# EAGLE schematic spi_lcd_v2 (EAGLE 6.1)
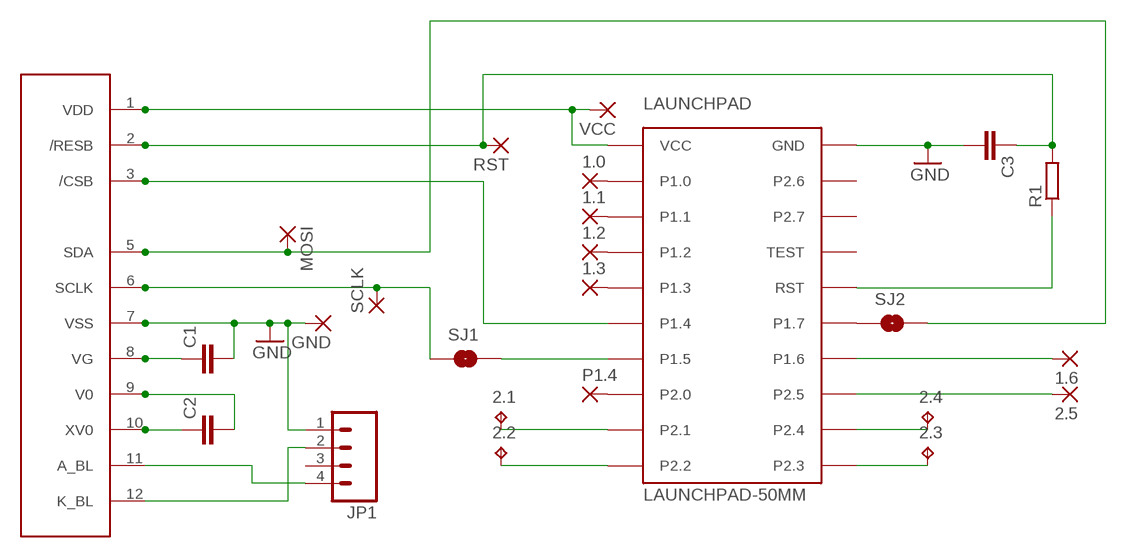
[diagram p0: schematic, sheet 1]

## Parts
1.0  2,15/1,0  [2,15/1,0]
1.1  2,15/1,0  [2,15/1,0]
1.2  2,15/1,0  [2,15/1,0]
1.3  2,15/1,0  [2,15/1,0]
1.6  2,15/1,0  [2,15/1,0]
2.1  TPTP07R  [TP07R]
2.2  TPTP07R  [TP07R]
2.3  TPTP07R  [TP07R]
2.4  TPTP07R  [TP07R]
2.5  2,15/1,0  [2,15/1,0]
C1  CAP1206  [1206]
C2  CAP1206  [1206]
C3  CAP1206  [1206]
GND  2,15/1,0  [2,15/1,0]
JP1  M04PTH  [1X04]
LAUNCHPAD  LAUNCHPAD-50MM  [LAUNCHPAD-50MM]
MOSI  2,15/1,0  [2,15/1,0]
P1.4  2,15/1,0  [2,15/1,0]
R1  R-EU_R1206  [R1206]
RST  2,15/1,0  [2,15/1,0]
SCLK  2,15/1,0  [2,15/1,0]
SJ1  SOLDERJUMPERTRACE  [SJ_2S-TRACE]
SJ2  SOLDERJUMPERTRACE  [SJ_2S-TRACE]
U$1  PE9665WRFPE9665WRF-WHOLE  [PE9665WRF]
VCC  2,15/1,0  [2,15/1,0]

## Nets
GND: C1.2 C3.2 GND.1(P) JP1.1 LAUNCHPAD.GND U$1.7(VSS)
N$1: C2.1 U$1.10(XV0)
N$2: C2.2 U$1.9(V0)
N$3: C1.1 U$1.8(VG)
N$4: 2.5.1(P) LAUNCHPAD.P2.5
N$5: C3.1 R1.2 RST.1(P) U$1.2(/RESB)
N$6: 1.0.1(P) LAUNCHPAD.P1.0
N$7: SCLK.1(P) SJ1.1 U$1.6(SCLK)
N$8: MOSI.1(P) SJ2.2 U$1.5(SDA)
N$9: LAUNCHPAD.P1.4 U$1.3(/CSB)
N$10: LAUNCHPAD.RST R1.1
N$11: 1.6.1(P) LAUNCHPAD.P1.6
N$12: 1.2.1(P) LAUNCHPAD.P1.2
N$13: 2.1.TP LAUNCHPAD.P2.1
N$14: 2.2.TP LAUNCHPAD.P2.2
N$15: 2.4.TP LAUNCHPAD.P2.4
N$16: 2.3.TP LAUNCHPAD.P2.3
N$17: 1.3.1(P) LAUNCHPAD.P1.3
N$18: LAUNCHPAD.P2.0 P1.4.1(P)
N$19: 1.1.1(P) LAUNCHPAD.P1.1
N$20: LAUNCHPAD.P1.7 SJ2.1
N$21: LAUNCHPAD.P1.5 SJ1.2
N$23: JP1.2 U$1.12(K_BL)
N$24: JP1.4 U$1.11(A_BL)
VDD: LAUNCHPAD.VCC U$1.1(VDD) VCC.1(P)
Unconnected: JP1.3 LAUNCHPAD.P2.6 LAUNCHPAD.P2.7 LAUNCHPAD.TEST

## Library data of the parts
1.0 1.1-1.3 1.6 2.5 GND MOSI P1.4 RST SCLK VCC = wirepad:2,15/1,0: THROUGH-HOLE PAD
2.1-2.4 = testpad:TP: Test pad
C1-C3 = SparkFun:CAP: Capacitor Standard 0603 ceramic capacitor, and 0.1" leaded capacitor.
JP1 = SparkFun-Connectors:M04: Header 4 Standard 4-pin 0.1" header. Use with straight break away headers (SKU : PRT-00116), right angle break away headers (PRT-00553), swiss pins (PRT-00743), machine pins (PRT-00117), and female headers (PRT-00115). Molex polarized connector foot print use with SKU : PRT-08231 with associated crimp pins and housings. 1MM SMD Version SKU: PRT-10208
LAUNCHPAD = TI_launchpad:LAUNCHPAD: MSP-EXP430G2 LaunchPad Booster Pack layouts. LAUNCHPAD: Full-size board LAUNCHPAD-50MM: 50x50mm board covering the button area LAUNCHPAD-50MM-LEFT: 50x50mm board leaving the button area open. Tall LaunchPad components marked on Reference for reference.
R1 = resistor:R-EU_: RESISTOR, European symbol
SJ1 SJ2 = SparkFun-Passives:SOLDERJUMPER: Solder Jumper Standard SMD solder jumper. Used to automate production. Two varients : Normally Open and Normally Closed are the same, but have different paste layers. NC will have a large amount of paste and should jumper during reflow.
U$1 = apus-spidisplay:PE9665WRF